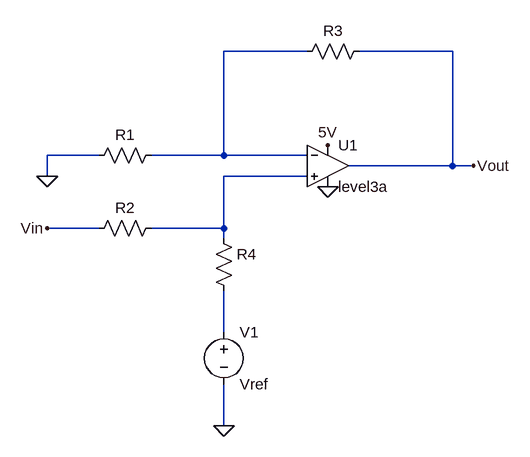
[diagram p0: schematic Draft1.asc]
Draft1.asc, the LTspice schematic file:
Version 4
SHEET 1 920 680
WIRE 592 -96 464 -96
WIRE 816 -96 672 -96
WIRE 272 64 192 64
WIRE 464 64 464 -96
WIRE 464 64 352 64
WIRE 592 64 464 64
WIRE 816 80 816 -96
WIRE 816 80 656 80
WIRE 848 80 816 80
WIRE 192 96 192 64
WIRE 592 96 464 96
WIRE 272 176 192 176
WIRE 464 176 464 96
WIRE 464 176 352 176
WIRE 464 192 464 176
WIRE 464 336 464 272
WIRE 464 480 464 416
FLAG 464 480 0
FLAG 624 112 0
FLAG 624 48 5V
FLAG 848 80 Vout
FLAG 192 96 0
FLAG 192 176 Vin
SYMBOL voltage 464 320 R0
SYMATTR InstName V1
SYMATTR Value Vref
SYMBOL res 448 176 R0
SYMATTR InstName R4
SYMATTR Value ""
SYMBOL res 368 160 R90
WINDOW 0 0 56 VBottom 2
WINDOW 3 32 56 VTop 2
SYMATTR InstName R2
SYMATTR Value ""
SYMBOL OpAmps\\UniversalOpAmp3 624 80 R0
SYMATTR InstName U1
SYMBOL res 688 -112 R90
WINDOW 0 0 56 VBottom 2
WINDOW 3 32 56 VTop 2
SYMATTR InstName R3
SYMATTR Value ""
SYMBOL res 368 48 R90
WINDOW 0 0 56 VBottom 2
WINDOW 3 32 56 VTop 2
SYMATTR InstName R1
SYMATTR Value ""

The netlist it stands for:
* Draft1.asc
V1 N003 0 Vref
R4 N002 N003
R2 N002 Vin
XU1 N002 N001 5V 0 Vout level3a  ; pins In+ In- V+ V- OUT
R3 Vout N001
R1 N001 0
.backanno
.end